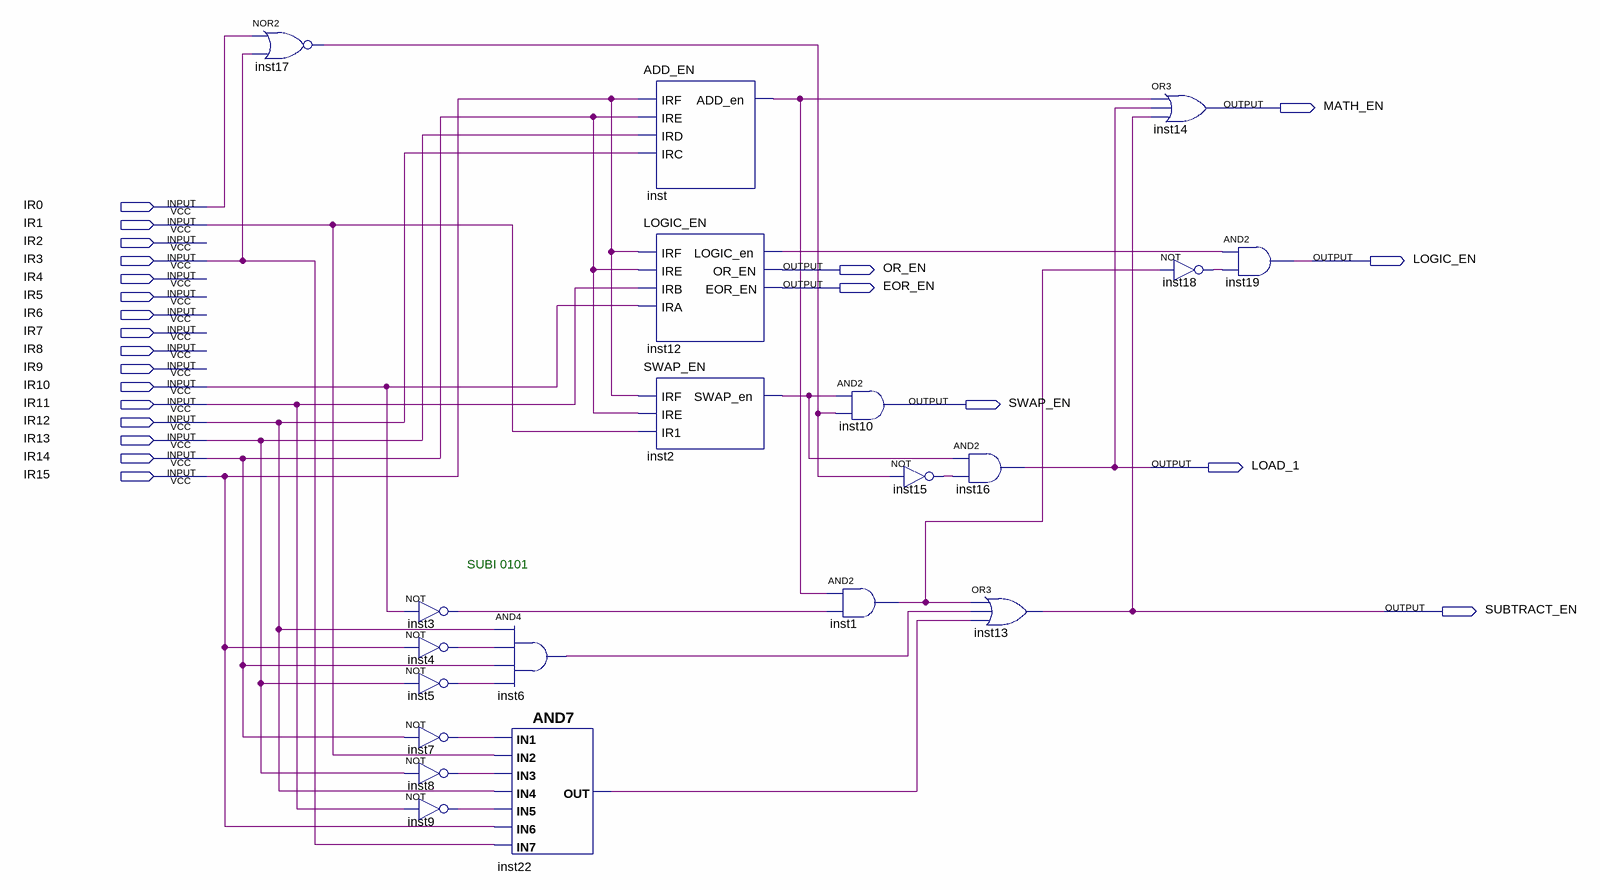
[diagram p0: schematic sheet]
// Quartus schematic ALU_Control.bdf as structural Verilog: 20 symbols, 23 pins
module ALU_Control (
  input  IR0,
  input  IR1,
  input  IR2,
  input  IR3,
  input  IR4,
  input  IR5,
  input  IR6,
  input  IR7,
  input  IR8,
  input  IR9,
  input  IR10,
  input  IR11,
  input  IR12,
  input  IR13,
  input  IR14,
  input  IR15,
  output MATH_EN,
  output LOGIC_EN,
  output OR_EN,
  output EOR_EN,
  output SWAP_EN,
  output LOAD_1,
  output SUBTRACT_EN
);

  wire inst1_out, inst2_swap_en, inst3_out, inst4_out, inst5_out, inst6_out, inst7_out, inst8_out, inst9_out,
       inst12_logic_en, inst15_out, inst17_out, inst18_out, inst22_out, inst_add_en;

  nor inst17 (inst17_out, IR0, IR3);
  not inst3 (inst3_out, IR10);
  not inst4 (inst4_out, IR15);
  not inst5 (inst5_out, IR13);
  not inst7 (inst7_out, IR14);
  not inst8 (inst8_out, IR13);
  not inst9 (inst9_out, IR11);
  and inst6 (inst6_out, IR12, inst4_out, IR14, inst5_out);
  and inst22 (inst22_out, inst7_out, IR1, inst8_out, IR12, inst9_out, IR15, IR3);
  ADD_EN inst (.IRF(IR15), .IRE(IR14), .IRD(IR13), .IRC(IR12), .ADD_en(inst_add_en));
  LOGIC_EN inst12 (
    .IRF(IR15), .IRE(IR14), .IRB(IR11), .IRA(IR10), .LOGIC_en(inst12_logic_en), .OR_EN(OR_EN), .EOR_EN(EOR_EN));
  SWAP_EN inst2 (.IRF(IR15), .IRE(IR14), .IR1(IR1), .SWAP_en(inst2_swap_en));
  and inst10 (SWAP_EN, inst2_swap_en, inst17_out);
  and inst1 (inst1_out, inst_add_en, inst3_out);
  not inst15 (inst15_out, inst17_out);
  and inst16 (LOAD_1, inst2_swap_en, inst15_out);
  or inst13 (SUBTRACT_EN, inst1_out, inst6_out, inst22_out);
  or inst14 (MATH_EN, inst_add_en, LOAD_1, SUBTRACT_EN);
  not inst18 (inst18_out, inst1_out);
  and inst19 (LOGIC_EN, inst12_logic_en, inst18_out);

  // Notes on the sheet:
  //   SUBI 0101
endmodule
